# EasyEDA schematic EasyEDA.json
TITLE: Sterowanie PWM; REV: 1.0; Date: 2019-03-05; Sheet: 1/1; Drawn By: Wiktor Buliński; Company: ZSE
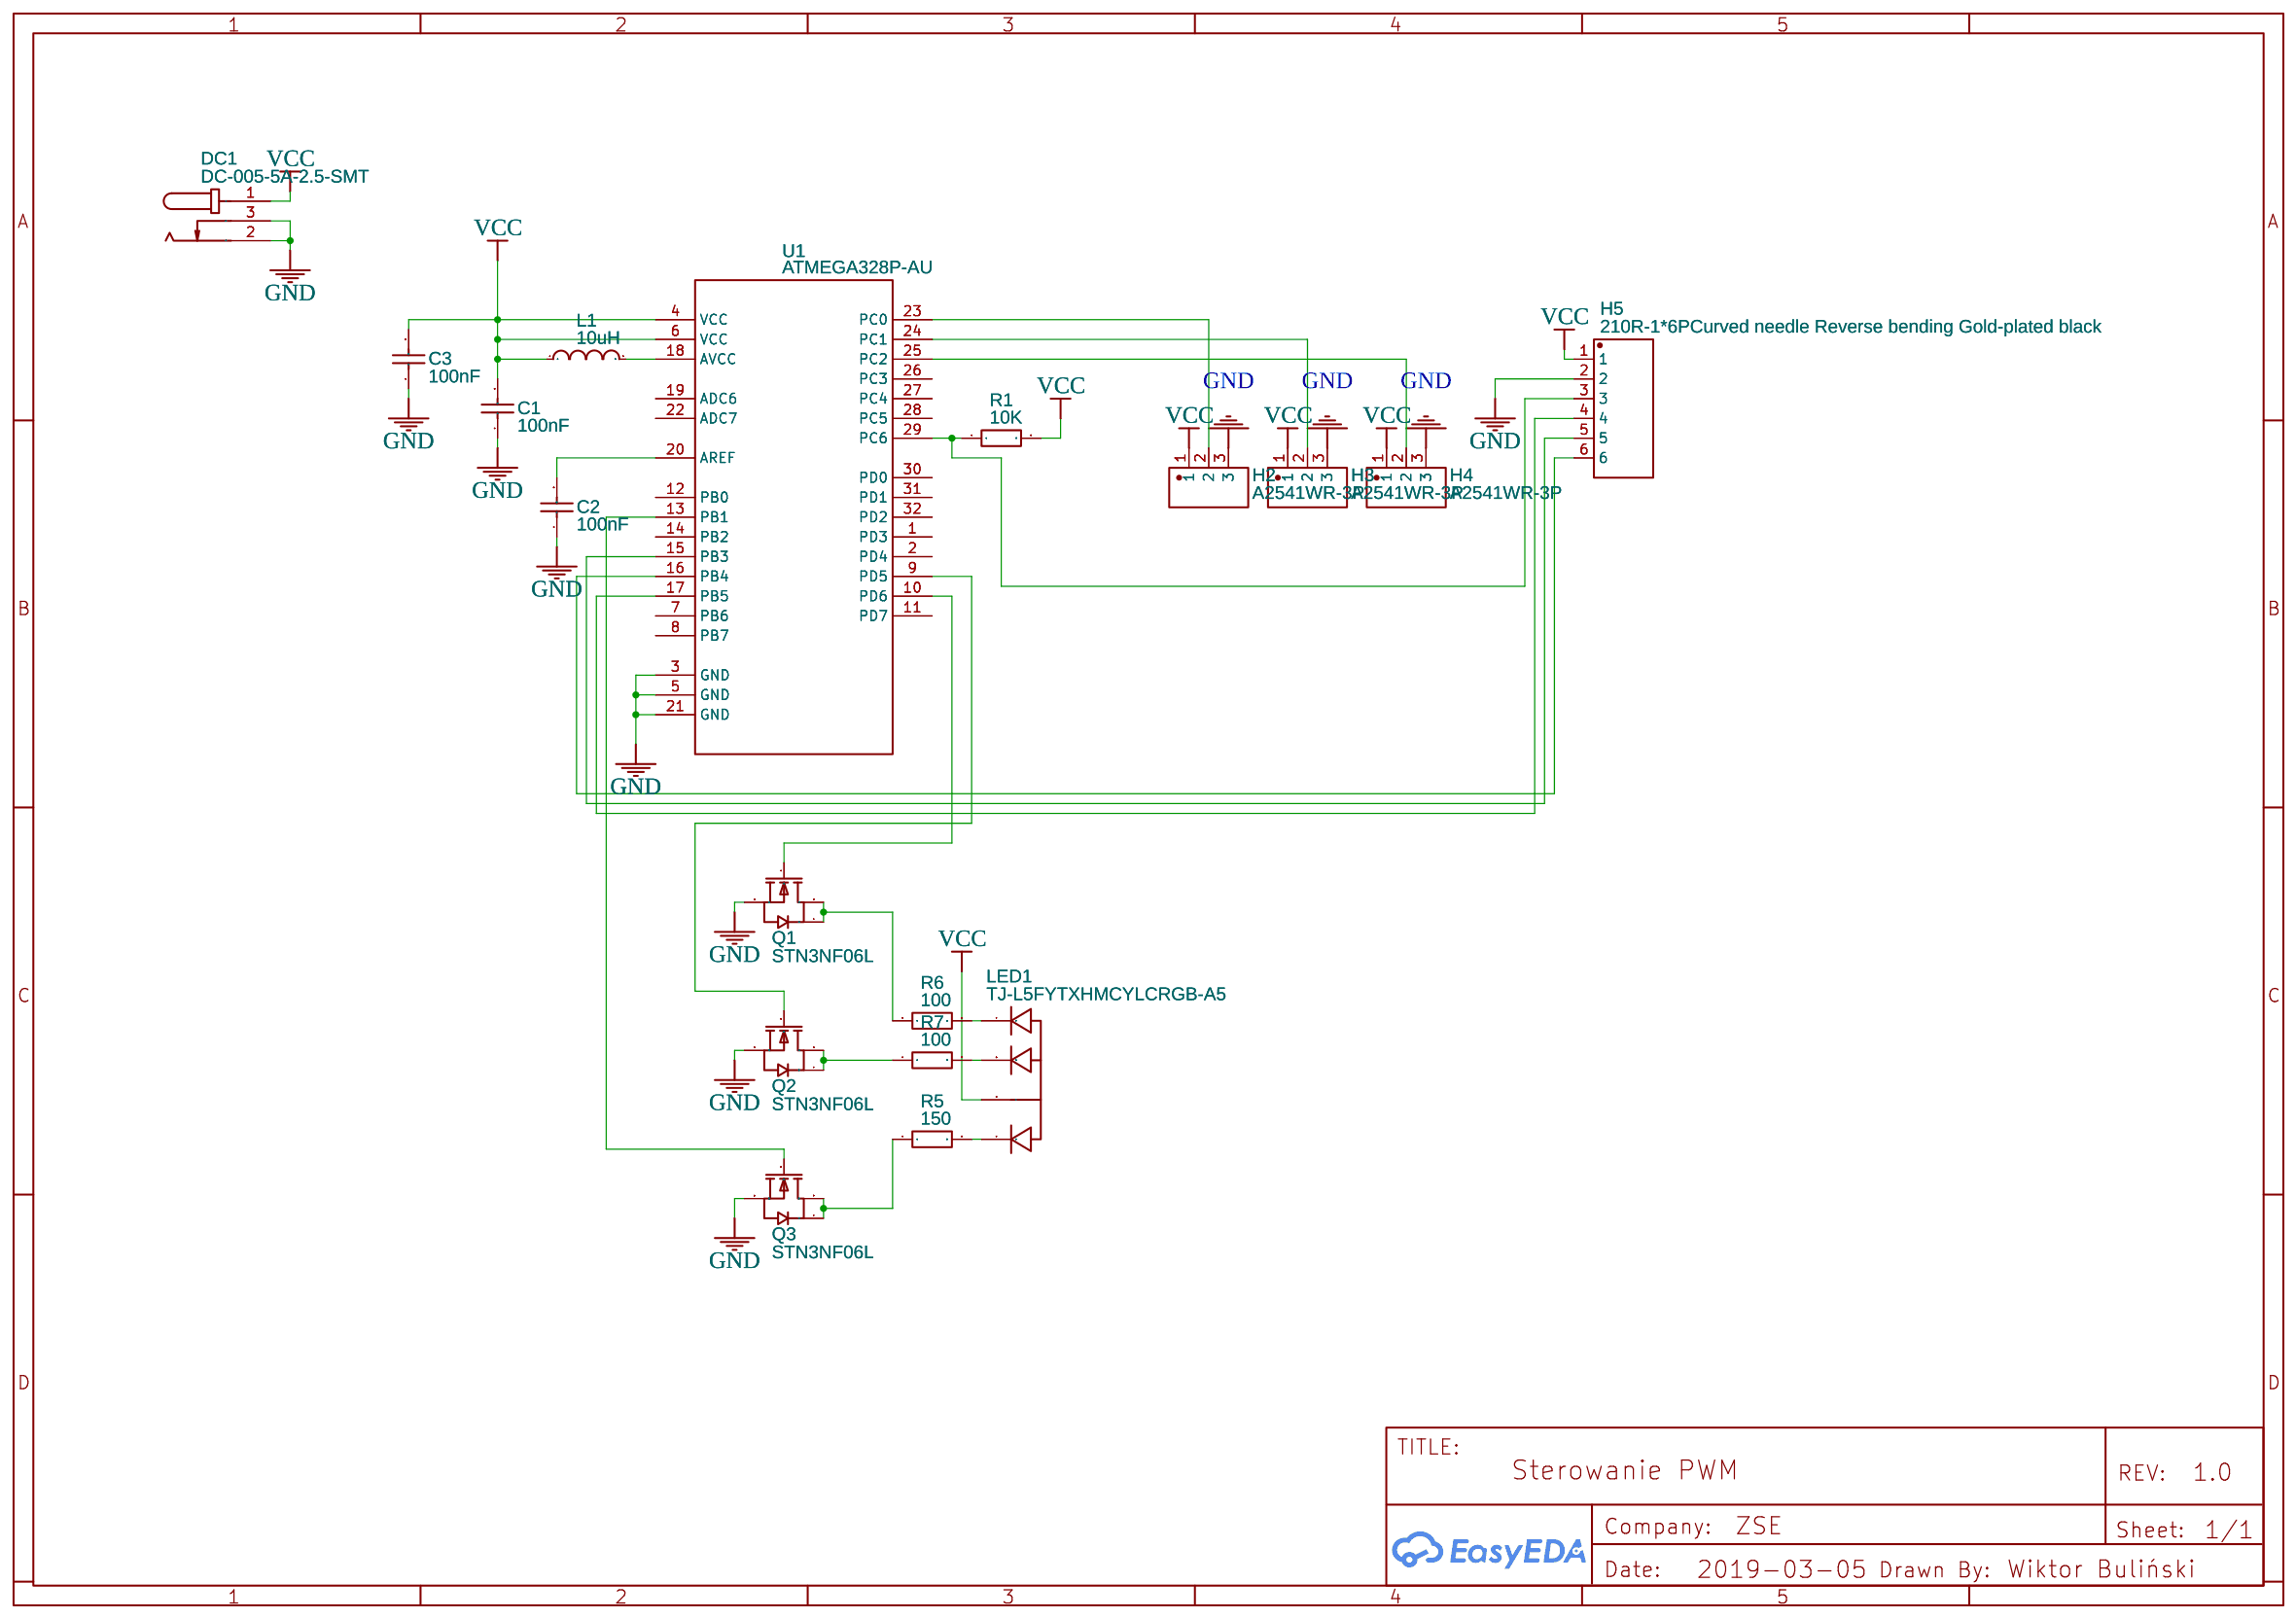
[diagram p0: schematic sheet]

## Parts
C1  100nF  [1206]
C2  100nF  [1206]
C3  100nF  [1206]
DC1  DC-005-5A-2.5-SMT  [DC-005-5A-2.0-SMT]
H2  A2541WR-3P  [SIP-2.54MM-3P-CJT-H2.54]
H3  A2541WR-3P  [SIP-2.54MM-3P-CJT-H2.54]
H4  A2541WR-3P  [SIP-2.54MM-3P-CJT-H2.54]
H5  210R-1*6PCurved needle Reverse bending Gold-plated black  [HDR-2.54-1X6PW]
L1  10uH  [1206]
LED1  TJ-L5FYTXHMCYLCRGB-A5  [LED-DIP-4P(5.8MM)]
Q1  STN3NF06L  [SOT-223]
Q2  STN3NF06L  [SOT-223]
Q3  STN3NF06L  [SOT-223]
R1  10K  [1206]
R5  150  [1206]
R6  100  [1206]
R7  100  [1206]
U1  ATMEGA328P-AU  [TQFP-32_7X7X08P]

## Library data of the parts
C1-C3 = CC1206KKX7R0BB104: Supplier: LCSC; Manufacturer: YAGEO; Supplier Part: C107181
DC1 = -: Supplier: LCSC; Supplier Part: C319133; Manufacturer: XKB Enterprise; Contributor: LCSC
H2-H4 = -: Supplier: LCSC; Supplier Part: C225489; Manufacturer: Changjiang Connectors; Contributor: LCSC
H5 = -: Supplier: LCSC; Manufacturer: Ckmtw; Contributor: LCSC; Supplier Part: C124367
L1 = CMP321609XD100KT: Supplier: LCSC; Manufacturer: FH; Supplier Part: C139251
LED1 = -: Supplier: LCSC; Supplier Part: C331057; Manufacturer: TOGIALED; Contributor: LCSC
Q1-Q3 = -: Supplier: LCSC; Supplier Part: C222218; Manufacturer: STMicroelectronics; Contributor: LCSC
R1 = 1206W4F1002T5E: Supplier: LCSC; Manufacturer: UniOhm; LCSC Assembly: Yes; Supplier Part: C17902
R5 = 1206W4F1500T5E: Supplier: LCSC; Manufacturer: UniOhm; Supplier Part: C17917
R6 R7 = AR06DTCV1000: Supplier: LCSC; Supplier Part: C319959; Manufacturer: Viking Tech; Contributor: LCSC
U1 = -: Supplier: LCSC; Manufacturer: MICROCHIP; image: //image.lceda.cn/szlcsc/C14877.jpg; Supplier Part: C14877

## Nets
GND: C1.1 C2.1 C3.1 DC1.2 DC1.3 H2.3 H3.3 H4.3 H5.2 Q1.3(S) Q2.3(S) Q3.3(S) U1.3(GND) U1.5(GND) U1.21(GND)
VCC: C1.2 C3.2 DC1.1 H2.1 H3.1 H4.1 H5.1 L1.1 LED1.2(+) R1.2 U1.4(VCC) U1.6(VCC)
Net-(C2-2): C2.2 U1.20(AREF)
Net-(H2-2): H2.2 U1.23(PC0)
Net-(H3-2): H3.2 U1.24(PC1)
Net-(H4-2): H4.2 U1.25(PC2)
Net-(H5-3): H5.3 R1.1 U1.29(PC6)
Net-(H5-4): H5.4 U1.17(PB5)
Net-(H5-5): H5.5 U1.15(PB3)
Net-(H5-6): H5.6 U1.16(PB4)
Net-(L1-2): L1.2 U1.18(AVCC)
Net-(LED1-1): LED1.1 R5.2
Net-(LED1-3): LED1.3 R7.2
Net-(LED1-4): LED1.4 R6.2
Net-(Q1-1): Q1.1(G) U1.10(PD6)
Net-(Q1-2): Q1.2(D) Q1.4(D) R6.1
Net-(Q2-1): Q2.1(G) U1.9(PD5)
Net-(Q2-2): Q2.2(D) Q2.4(D) R7.1
Net-(Q3-1): Q3.1(G) U1.13(PB1)
Net-(Q3-2): Q3.2(D) Q3.4(D) R5.1

Not connected (* = marked no-connect by the designer): U1 1(PD3) 2(PD4) 7(PB6) 8(PB7) 11(PD7) 12(PB0) 14(PB2) 19(ADC6) 22(ADC7) 26(PC3) 27(PC4) 28(PC5) 30(PD0) 31(PD1) 32(PD2)
